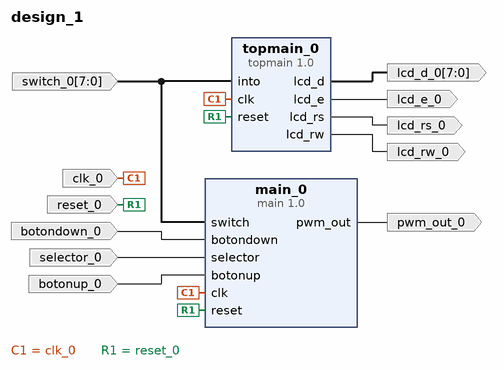
[diagram p0: block diagram of the top level]
# Vivado block design design_1, xc7a35tcpg236-1, Vivado 2018.3
create_bd_design design_1

create_bd_port -dir O lcd_rw_0
create_bd_port -dir I botondown_0
create_bd_port -dir I selector_0
create_bd_port -dir I botonup_0
create_bd_port -dir I -type clk clk_0
create_bd_port -dir I -type rst reset_0
create_bd_port -dir I -from 7 -to 0 switch_0
create_bd_port -dir O lcd_rs_0
create_bd_port -dir O lcd_e_0
create_bd_port -dir O -from 7 -to 0 lcd_d_0
create_bd_port -dir O pwm_out_0

create_bd_cell -type ip -vlnv user.org:user:topmain:1.0 topmain_0
create_bd_cell -type ip -vlnv user.org:user:main:1.0 main_0

# ---- connections ----

connect_bd_net [get_bd_pins topmain_0/lcd_rw] [get_bd_ports lcd_rw_0]
connect_bd_net -net botondown_0_1 [get_bd_ports botondown_0] [get_bd_pins main_0/botondown]
connect_bd_net -net selector_0_1 [get_bd_ports selector_0] [get_bd_pins main_0/selector]
connect_bd_net -net botonup_0_1 [get_bd_ports botonup_0] [get_bd_pins main_0/botonup]
connect_bd_net -net clk_0_1 [get_bd_ports clk_0] [get_bd_pins topmain_0/clk] [get_bd_pins main_0/clk]
connect_bd_net -net reset_0_1 [get_bd_ports reset_0] [get_bd_pins topmain_0/reset] [get_bd_pins main_0/reset]
connect_bd_net -net switch_0_1 [get_bd_ports switch_0] [get_bd_pins topmain_0/into] [get_bd_pins main_0/switch]
connect_bd_net [get_bd_pins topmain_0/lcd_rs] [get_bd_ports lcd_rs_0]
connect_bd_net [get_bd_pins topmain_0/lcd_e] [get_bd_ports lcd_e_0]
connect_bd_net [get_bd_pins topmain_0/lcd_d] [get_bd_ports lcd_d_0]
connect_bd_net [get_bd_pins main_0/pwm_out] [get_bd_ports pwm_out_0]

validate_bd_design
save_bd_design
